# Altium schematic sheet Encoder_PCB.SchDoc
size A4; Date: 2025-4-19; DrawnBy: 曹子建; Time: 2025-4-19
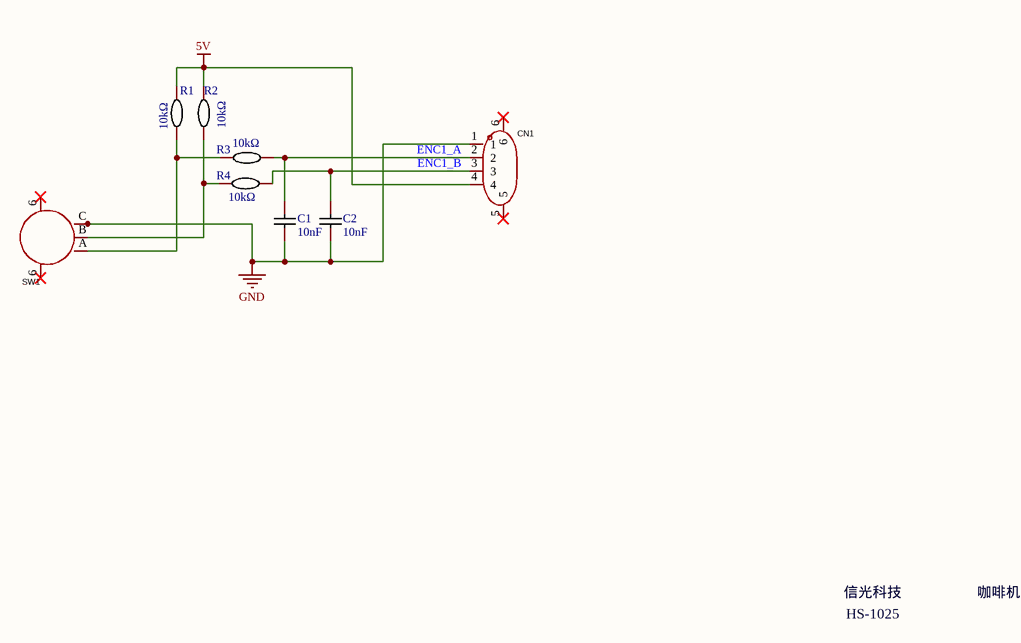
[diagram p0: Encoder_PCB.SchDoc]

## Parts
C1  Name: 10nF  [C0603]  (hidden comment: CC0603KRX7R9BB103)
C2  Name: 10nF  [C0603]  (hidden comment: CC0603KRX7R9BB103)
CN1  WAFER-GH1.25-4PLB  [CONN-SMD_4P-P1.25_XUNPU_WAFER-GH1.25-4PLB]  (value not drawn)
R1  10kΩ  [R0603]
R2  10kΩ  [R0603]
R3  10kΩ  [R0603]
R4  10kΩ  [R0603]
SW1  PEC16-4120F-N0012  [SW-SMD_PEC16-4120F-N0012]  (value not drawn)

## Nets
5V: CN1.4 R1.1 R2.1
GND: C1.1 C2.1 CN1.1 SW1.C
ENC1_A: C1.2 CN1.2 R3.1
ENC1_B: C2.2 CN1.3 R4.1
NetR1_2: R1.2 R3.2 SW1.A
NetR2_2: R2.2 R4.2 SW1.B

Not connected (* = marked no-connect by the designer): CN1 5* 6*; SW1 6*

## Notes on the sheet
- 信光科技
- 咖啡机
- HS-1025
- 版本号
- 日期
- 修改原因
- V1.0
- 客户
- HuiJun Technology Group Co.,Ltd
- 产品
- 审核
- 制图
- 型号
- 批准

## Library data of the parts
C1 C2 = CC0603KRX7R9BB103: Manufacturer: YAGEO(国巨); Add into BOM: yes; Value: 10nF; Tolerance: ±10%; Voltage Rated: 50V; Temperature Coefficient: X7R; Symbol: CC0603KRX7R9BB103; Device: CC0603KRX7R9BB103; LCSC Part Name: 10nF ±10% 50V; Supplier Part: C100042; Manufacturer Part: CC0603KRX7R9BB103; Supplier Footprint: 0603; JLCPCB Part Class: Extended Part; Datasheet: https://atta.szlcsc.com/upload/public/pdf/source/20180326/C100042_E8B0111D51DE3671A0A4A59FBCEFE81C.pdf; Supplier: LCSC; Convert to PCB: yes
CN1 = WAFER-GH1.25-4PLB: Manufacturer: XUNPU(讯普); Add into BOM: yes; Pins Structure: 1x4P; Pitch: 1.25mm; Reference Series: GH; Number of PINs Per Row: 4; Current Rating (Max): 1A; Symbol: WAFER-GH1.25-4PLB; Device: WAFER-GH1.25-4PLB; LCSC Part Name: 1x4P 间距:1.25mm 立贴 系列:GH; Supplier Part: C3029370; Manufacturer Part: WAFER-GH1.25-4PLB; Supplier Footprint: SMD,P=1.25mm; JLCPCB Part Class: Extended Part; Datasheet: https://atta.szlcsc.com/upload/public/pdf/source/20220527/44F824AAC8C2B617205E15955FF9C23D.pdf; Supplier: LCSC; Convert to PCB: yes; Mounting Style: 立贴; Number of Pins: 4P; Number of Rows: 1; Operating Temperature Range: -25℃~+85℃
R1-R4 = 0603WAF1002T5E: Manufacturer: UNI-ROYAL(厚声); Add into BOM: yes; Resistance: 10K; Name: 10kΩ; Symbol: 10kΩ; Device: 0603WAF1002T5E; Supplier: LCSC; Manufacturer Part: 0603WAF1002T5E; Supplier Part: C25804; JLCPCB Part Class: Basic Part; Convert to PCB: yes; Origin Footprint: R0603
SW1 = PEC16-4120F-N0012: Manufacturer: BOURNS; Add into BOM: yes; Symbol: PEC16-4120F-N0012; Device: PEC16-4120F-N0012; LCSC Part Name: PEC16-4120F-N0012(三件套); Supplier Part: C143807; Manufacturer Part: PEC16-4120F-N0012; Supplier Footprint: 插件; JLCPCB Part Class: Extended Part; Datasheet: https://atta.szlcsc.com/upload/public/pdf/source/20180126/C143807_15169559432171309032.pdf; Supplier: LCSC; Convert to PCB: yes